# Altium schematic sheet Nucleo_shield.SchDoc
size A4
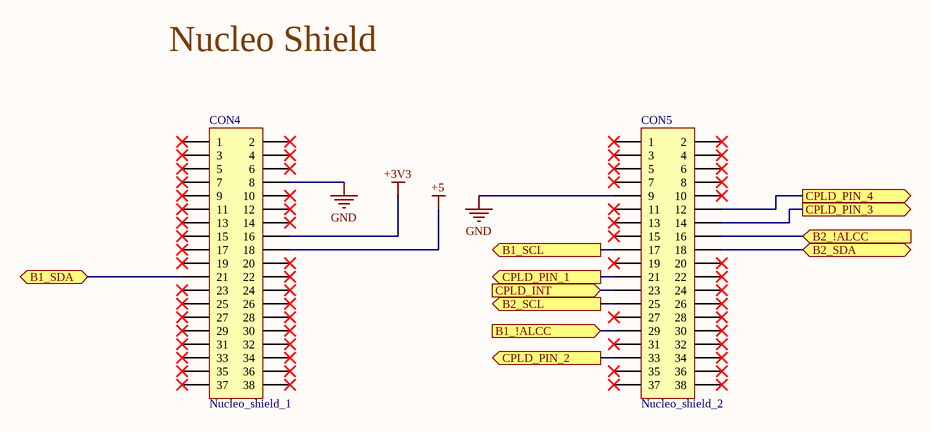
[diagram p0: Nucleo_shield.SchDoc]

## Parts
CON4  Nucleo_shield_1  [HDR2X19]
CON5  Nucleo_shield_2  [HDR2X19]

## Ports
B1_!ALCC (in), B1_SCL (out), B1_SDA (bidir), B2_!ALCC (in), B2_SCL (out), B2_SDA (bidir), CPLD_INT (in), CPLD_PIN_1 (out), CPLD_PIN_2 (out), CPLD_PIN_3 (out), CPLD_PIN_4 (out)

## Nets
+3V3: CON4.16
+5: CON4.18
GND: CON4.8 CON5.9
B1_!ALCC: CON5.29 ; port B1_!ALCC
B1_SCL: CON5.17 ; port B1_SCL
B1_SDA: CON4.21 ; port B1_SDA
B2_!ALCC: CON5.16 ; port B2_!ALCC
B2_SCL: CON5.25 ; port B2_SCL
B2_SDA: CON5.18 ; port B2_SDA
CPLD_INT: CON5.23 ; port CPLD_INT
CPLD_PIN_1: CON5.21 ; port CPLD_PIN_1
CPLD_PIN_2: CON5.33 ; port CPLD_PIN_2
CPLD_PIN_3: CON5.14 ; port CPLD_PIN_3
CPLD_PIN_4: CON5.12 ; port CPLD_PIN_4

Not connected (* = marked no-connect by the designer): CON4 1* 2* 3* 4* 5* 6* 7* 9* 10* 11* 12* 13* 14* 15* 17* 19* 20* 22* 23* 24* 25* 26* 27* 28* 29* 30* 31* 32* 33* 34* 35* 36* 37* 38*; CON5 1* 2* 3* 4* 5* 6* 7* 8* 10* 11* 13* 15* 19* 20* 22* 24* 26* 27* 28* 30* 31* 32* 34* 35* 36* 37* 38*

## Notes on the sheet
- Nucleo Shield
- Title
- Size:
- Date:
- Battery Management System
- A4
- Number:
- Time:
- 1
- Revision:
- Author: GEI Corp
- V1.0
- GEI Corp
- 135 avenue de Rangueil
- INSA Toulouse
- 31400 Toulouse
- FRANCE
- File:
- Projet_Inter_1\BMS_GEI_CORP

## Library data of the parts
CON4 CON5 = Header 19X2: Header, 19-Pin, Dual row; LatestRevisionDate: 17-Jul-2002; LatestRevisionNote: Re-released for DXP Platform.; Publisher: Altium Limited